# Altium schematic sheet MPU Allwinner A33.SchDoc
size A2; SheetNumber: 9; SheetTotal: 9
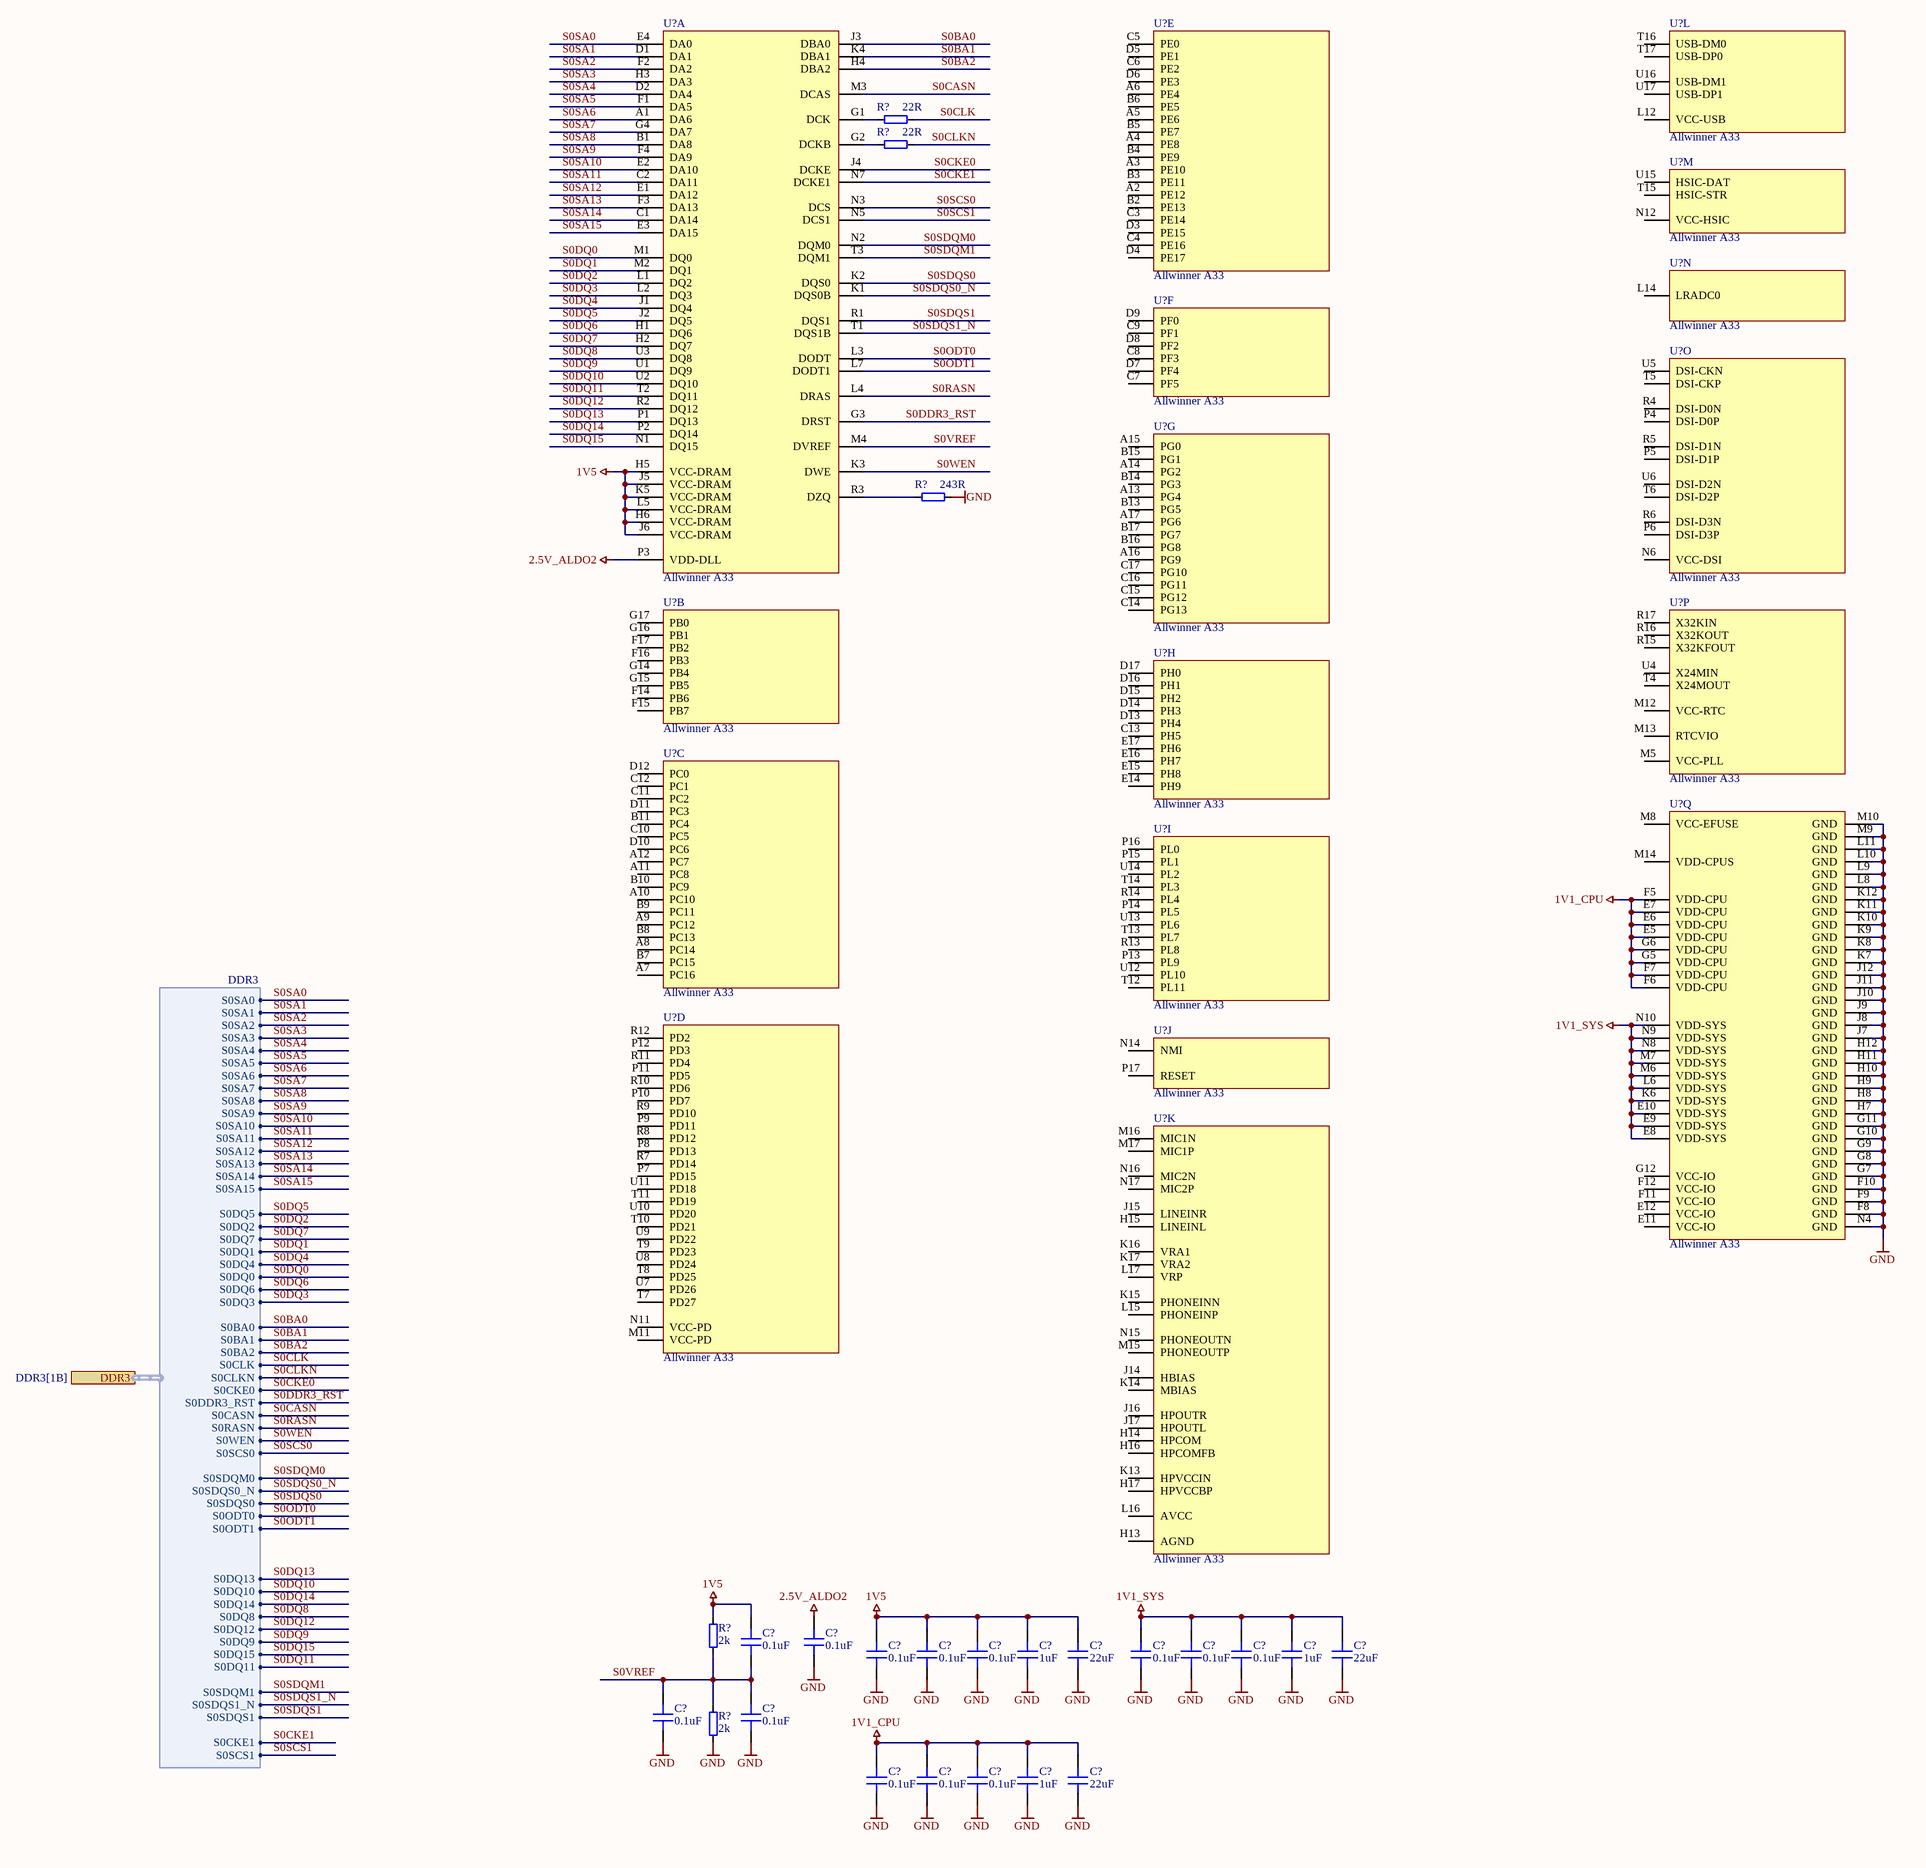
[diagram p0: MPU Allwinner A33.SchDoc]

## Parts
(Parts that share a designator on the sheet are numbered #1, #2 ... from top to bottom, then left to right.)
C?#1  0.1uF  [CAPC1005X06N]
C?#2  0.1uF  [CAPC1005X06N]
C?#3  0.1uF  [CAPC1005X06N]
C?#4  0.1uF  [CAPC1005X06N]
C?#5  0.1uF  [CAPC1005X06N]
C?#6  1uF  [CAPC1608X09N]
C?#7  22uF  [CAPC3216X16N]
C?#8  0.1uF  [CAPC1005X06N]
C?#9  0.1uF  [CAPC1005X06N]
C?#10  0.1uF  [CAPC1005X06N]
C?#11  1uF  [CAPC1608X09N]
C?#12  22uF  [CAPC3216X16N]
C?#13  0.1uF  [CAPC1005X06N]
C?#14  0.1uF  [CAPC1005X06N]
C?#15  0.1uF  [CAPC1005X06N]
C?#16  0.1uF  [CAPC1005X06N]
C?#17  0.1uF  [CAPC1005X06N]
C?#18  1uF  [CAPC1608X09N]
C?#19  22uF  [CAPC3216X16N]
R?#1  22R  [RESC1005X35N]
R?#2  22R  [RESC1005X35N]
R?#3  243R  [RESC1005X35N]
R?#4  2k  [RESC1005X35N]
R?#5  2k  [RESC1005X35N]
U?#1  Allwinner A33  [BGA282C80P17X17_1400X1400X130(Allwinner A33)]  (part L of 17)
U?#2  Allwinner A33  [BGA282C80P17X17_1400X1400X130(Allwinner A33)]  (part E of 17)
U?#3  Allwinner A33  [BGA282C80P17X17_1400X1400X130(Allwinner A33)]  (part M of 17)
U?#4  Allwinner A33  [BGA282C80P17X17_1400X1400X130(Allwinner A33)]  (part N of 17)
U?#5  Allwinner A33  [BGA282C80P17X17_1400X1400X130(Allwinner A33)]  (part A of 17)
U?#6  Allwinner A33  [BGA282C80P17X17_1400X1400X130(Allwinner A33)]  (part F of 17)
U?#7  Allwinner A33  [BGA282C80P17X17_1400X1400X130(Allwinner A33)]  (part O of 17)
U?#8  Allwinner A33  [BGA282C80P17X17_1400X1400X130(Allwinner A33)]  (part G of 17)
U?#9  Allwinner A33  [BGA282C80P17X17_1400X1400X130(Allwinner A33)]  (part B of 17)
U?#10  Allwinner A33  [BGA282C80P17X17_1400X1400X130(Allwinner A33)]  (part P of 17)
U?#11  Allwinner A33  [BGA282C80P17X17_1400X1400X130(Allwinner A33)]  (part H of 17)
U?#12  Allwinner A33  [BGA282C80P17X17_1400X1400X130(Allwinner A33)]  (part C of 17)
U?#13  Allwinner A33  [BGA282C80P17X17_1400X1400X130(Allwinner A33)]  (part I of 17)
U?#14  Allwinner A33  [BGA282C80P17X17_1400X1400X130(Allwinner A33)]  (part Q of 17)
U?#15  Allwinner A33  [BGA282C80P17X17_1400X1400X130(Allwinner A33)]  (part J of 17)
U?#16  Allwinner A33  [BGA282C80P17X17_1400X1400X130(Allwinner A33)]  (part D of 17)
U?#17  Allwinner A33  [BGA282C80P17X17_1400X1400X130(Allwinner A33)]  (part K of 17)

## Ports
DDR3 (harness DDR3, see DDR3[1B])

## Harnesses
DDR3: S0SA0, S0SA1, S0SA2, S0SA3, S0SA4, S0SA5, S0SA6, S0SA7, S0SA8, S0SA9, S0SA10, S0SA11, S0SA12, S0SA13, S0SA14, S0SA15, S0DQ5, S0DQ2, S0DQ7, S0DQ1, S0DQ4, S0DQ0, S0DQ6, S0DQ3, S0BA0, S0BA1, S0BA2, S0CLK, S0CLKN, S0CKE0, S0DDR3_RST, S0CASN, S0RASN, S0WEN, S0SCS0, S0SDQM0, S0SDQS0_N, S0SDQS0, S0ODT0, S0ODT1, S0DQ13, S0DQ10, S0DQ14, S0DQ8, S0DQ12, S0DQ9, S0DQ15, S0DQ11, S0SDQM1, S0SDQS1_N, S0SDQS1, S0CKE1, S0SCS1

## Nets
1V1_CPU: C?#15.1 C?#16.1 C?#17.1 C?#18.1 C?#19.2 U?#14.E5(VDD-CPU) U?#14.E6(VDD-CPU) U?#14.E7(VDD-CPU) U?#14.F5(VDD-CPU) U?#14.F6(VDD-CPU) U?#14.F7(VDD-CPU) U?#14.G5(VDD-CPU) U?#14.G6(VDD-CPU)
1V1_SYS: C?#8.1 C?#9.1 C?#10.1 C?#11.1 C?#12.2 U?#14.E8(VDD-SYS) U?#14.E9(VDD-SYS) U?#14.E10(VDD-SYS) U?#14.K6(VDD-SYS) U?#14.L6(VDD-SYS) U?#14.M6(VDD-SYS) U?#14.M7(VDD-SYS) U?#14.N8(VDD-SYS) U?#14.N9(VDD-SYS) U?#14.N10(VDD-SYS)
1V5: C?#1.1 C?#3.1 C?#4.1 C?#5.1 C?#6.1 C?#7.2 R?#4.1 U?#5.H5(VCC-DRAM) U?#5.H6(VCC-DRAM) U?#5.J5(VCC-DRAM) U?#5.J6(VCC-DRAM) U?#5.K5(VCC-DRAM) U?#5.L5(VCC-DRAM)
2.5V_ALDO2: C?#2.1 U?#5.P3(VDD-DLL)
GND: C?#2.2 C?#3.2 C?#4.2 C?#5.2 C?#6.2 C?#7.1 C?#8.2 C?#9.2 C?#10.2 C?#11.2 C?#12.1 C?#13.2 C?#14.2 C?#15.2 C?#16.2 C?#17.2 C?#18.2 C?#19.1 R?#3.1 R?#5.2 U?#14.F8(GND) U?#14.F9(GND) U?#14.F10(GND) U?#14.G7(GND) U?#14.G8(GND) U?#14.G9(GND) U?#14.G10(GND) U?#14.G11(GND) U?#14.H7(GND) U?#14.H8(GND) U?#14.H9(GND) U?#14.H10(GND) U?#14.H11(GND) U?#14.H12(GND) U?#14.J7(GND) U?#14.J8(GND) U?#14.J9(GND) U?#14.J10(GND) U?#14.J11(GND) U?#14.J12(GND) U?#14.K7(GND) U?#14.K8(GND) U?#14.K9(GND) U?#14.K10(GND) U?#14.K11(GND) U?#14.K12(GND) U?#14.L8(GND) U?#14.L9(GND) U?#14.L10(GND) U?#14.L11(GND) U?#14.M9(GND) U?#14.M10(GND) U?#14.N4(GND)
S0BA0: U?#5.J3(DBA0) ; port DDR3.S0BA0
S0BA1: U?#5.K4(DBA1) ; port DDR3.S0BA1
S0BA2: U?#5.H4(DBA2) ; port DDR3.S0BA2
S0CASN: U?#5.M3(DCAS) ; port DDR3.S0CASN
S0CKE0: U?#5.J4(DCKE) ; port DDR3.S0CKE0
S0CKE1: U?#5.N7(DCKE1) ; port DDR3.S0CKE1
S0CLK: R?#1.1 ; port DDR3.S0CLK
S0CLKN: R?#2.1 ; port DDR3.S0CLKN
S0DDR3_RST: U?#5.G3(DRST) ; port DDR3.S0DDR3_RST
S0DQ0: U?#5.M1(DQ0) ; port DDR3.S0DQ0
S0DQ1: U?#5.M2(DQ1) ; port DDR3.S0DQ1
S0DQ2: U?#5.L1(DQ2) ; port DDR3.S0DQ2
S0DQ3: U?#5.L2(DQ3) ; port DDR3.S0DQ3
S0DQ4: U?#5.J1(DQ4) ; port DDR3.S0DQ4
S0DQ5: U?#5.J2(DQ5) ; port DDR3.S0DQ5
S0DQ6: U?#5.H1(DQ6) ; port DDR3.S0DQ6
S0DQ7: U?#5.H2(DQ7) ; port DDR3.S0DQ7
S0DQ8: U?#5.U3(DQ8) ; port DDR3.S0DQ8
S0DQ9: U?#5.U1(DQ9) ; port DDR3.S0DQ9
S0DQ10: U?#5.U2(DQ10) ; port DDR3.S0DQ10
S0DQ11: U?#5.T2(DQ11) ; port DDR3.S0DQ11
S0DQ12: U?#5.R2(DQ12) ; port DDR3.S0DQ12
S0DQ13: U?#5.P1(DQ13) ; port DDR3.S0DQ13
S0DQ14: U?#5.P2(DQ14) ; port DDR3.S0DQ14
S0DQ15: U?#5.N1(DQ15) ; port DDR3.S0DQ15
S0ODT0: U?#5.L3(DODT) ; port DDR3.S0ODT0
S0ODT1: U?#5.L7(DODT1) ; port DDR3.S0ODT1
S0RASN: U?#5.L4(DRAS) ; port DDR3.S0RASN
S0SA0: U?#5.E4(DA0) ; port DDR3.S0SA0
S0SA1: U?#5.D1(DA1) ; port DDR3.S0SA1
S0SA2: U?#5.F2(DA2) ; port DDR3.S0SA2
S0SA3: U?#5.H3(DA3) ; port DDR3.S0SA3
S0SA4: U?#5.D2(DA4) ; port DDR3.S0SA4
S0SA5: U?#5.F1(DA5) ; port DDR3.S0SA5
S0SA6: U?#5.A1(DA6) ; port DDR3.S0SA6
S0SA7: U?#5.G4(DA7) ; port DDR3.S0SA7
S0SA8: U?#5.B1(DA8) ; port DDR3.S0SA8
S0SA9: U?#5.F4(DA9) ; port DDR3.S0SA9
S0SA10: U?#5.E2(DA10) ; port DDR3.S0SA10
S0SA11: U?#5.C2(DA11) ; port DDR3.S0SA11
S0SA12: U?#5.E1(DA12) ; port DDR3.S0SA12
S0SA13: U?#5.F3(DA13) ; port DDR3.S0SA13
S0SA14: U?#5.C1(DA14) ; port DDR3.S0SA14
S0SA15: U?#5.E3(DA15) ; port DDR3.S0SA15
S0SCS0: U?#5.N3(DCS) ; port DDR3.S0SCS0
S0SCS1: U?#5.N5(DCS1) ; port DDR3.S0SCS1
S0SDQM0: U?#5.N2(DQM0) ; port DDR3.S0SDQM0
S0SDQM1: U?#5.T3(DQM1) ; port DDR3.S0SDQM1
S0SDQS0: U?#5.K2(DQS0) ; port DDR3.S0SDQS0
S0SDQS0_N: U?#5.K1(DQS0B) ; port DDR3.S0SDQS0_N
S0SDQS1: U?#5.R1(DQS1) ; port DDR3.S0SDQS1
S0SDQS1_N: U?#5.T1(DQS1B) ; port DDR3.S0SDQS1_N
S0VREF: C?#1.2 C?#13.1 C?#14.1 R?#4.2 R?#5.1 U?#5.M4(DVREF)
S0WEN: U?#5.K3(DWE) ; port DDR3.S0WEN
NetR?#1_2: R?#1.2 U?#5.G1(DCK)
NetR?#2_2: R?#2.2 U?#5.G2(DCKB)
NetR?#3_2: R?#3.2 U?#5.R3(DZQ)

Not connected (* = marked no-connect by the designer): U?#1 L12(VCC-USB) T16(USB-DM0) T17(USB-DP0) U16(USB-DM1) U17(USB-DP1); U?#2 A2(PE12) A3(PE10) A4(PE8) A5(PE6) A6(PE4) B2(PE13) B3(PE11) B4(PE9) B5(PE7) B6(PE5) C3(PE14) C4(PE16) C5(PE0) C6(PE2) D3(PE15) D4(PE17) D5(PE1) D6(PE3); U?#3 N12(VCC-HSIC) T15(HSIC-STR) U15(HSIC-DAT); U?#4 L14(LRADC0); U?#6 C7(PF5) C8(PF3) C9(PF1) D7(PF4) D8(PF2) D9(PF0); U?#7 N6(VCC-DSI) P4(DSI-D0P) P5(DSI-D1P) P6(DSI-D3P) R4(DSI-D0N) R5(DSI-D1N) R6(DSI-D3N) T5(DSI-CKP) T6(DSI-D2P) U5(DSI-CKN) U6(DSI-D2N); U?#8 A13(PG4) A14(PG2) A15(PG0) A16(PG9) A17(PG6) B13(PG5) B14(PG3) B15(PG1) B16(PG8) B17(PG7) C14(PG13) C15(PG12) C16(PG11) C17(PG10); U?#9 F14(PB6) F15(PB7) F16(PB3) F17(PB2) G14(PB4) G15(PB5) G16(PB1) G17(PB0); U?#10 M5(VCC-PLL) M12(VCC-RTC) M13(RTCVIO) R15(X32KFOUT) R16(X32KOUT) R17(X32KIN) T4(X24MOUT) U4(X24MIN); U?#11 C13(PH5) D13(PH4) D14(PH3) D15(PH2) D16(PH1) D17(PH0) E14(PH9) E15(PH8) E16(PH7) E17(PH6); U?#12 A7(PC16) A8(PC14) A9(PC12) A10(PC10) A11(PC8) A12(PC7) B7(PC15) B8(PC13) B9(PC11) B10(PC9) B11(PC4) C10(PC5) C11(PC2) C12(PC1) D10(PC6) D11(PC3) D12(PC0); U?#13 P13(PL9) P14(PL5) P15(PL1) P16(PL0) R13(PL8) R14(PL4) T12(PL11) T13(PL7) T14(PL3) U12(PL10) U13(PL6) U14(PL2); U?#14 E11(VCC-IO) E12(VCC-IO) F11(VCC-IO) F12(VCC-IO) G12(VCC-IO) M8(VCC-EFUSE) M14(VDD-CPUS); U?#15 N14(NMI) P17(RESET); U?#16 M11(VCC-PD) N11(VCC-PD) P7(PD15) P8(PD13) P9(PD11) P10(PD7) P11(PD5) P12(PD3) R7(PD14) R8(PD12) R9(PD10) R10(PD6) R11(PD4) R12(PD2) T7(PD27) T8(PD25) T9(PD23) T10(PD21) T11(PD19) U7(PD26) U8(PD24) U9(PD22) U10(PD20) U11(PD18); U?#17 H13(AGND) H14(HPCOM) H15(LINEINL) H16(HPCOMFB) H17(HPVCCBP) J14(HBIAS) J15(LINEINR) J16(HPOUTR) J17(HPOUTL) K13(HPVCCIN) K14(MBIAS) K15(PHONEINN) K16(VRA1) K17(VRA2) L15(PHONEINP) L16(AVCC) L17(VRP) M15(PHONEOUTP) M16(MIC1N) M17(MIC1P) N15(PHONEOUTN) N16(MIC2N) N17(MIC2P)

## Library data of the parts
C?#1-C?#5 C?#8-C?#10 C?#13-C?#17 = 0402B104K500CT: Manufacturer: Walsin Tech Corp; Voltage: 50V; Tolerance: 10%; Dielectric: X7R; Min Temperature: -55; Max Temperature: 125; Part Number: 0402B104K500CT; ComponentLink1URL: https://datasheet.lcsc.com/lcsc/1810191621_Walsin-Tech-Corp-0402B104K500CT_C152814.pdf; ComponentLink1Description: Datasheet; Package: 0402; Part Status: Active; Capacitance: 0.1uF
C?#6 C?#11 C?#18 = 0603B105K160CT: Manufacturer: Walsin Tech Corp; Voltage: 16V; Tolerance: 10%; Dielectric: X7R; Min Temperature: -55; Max Temperature: 125; Part Number: 0603B105K160CT; ComponentLink1URL: https://datasheet.lcsc.com/lcsc/1811151141_Walsin-Tech-Corp-0603B105K160CT_C108463.pdf; ComponentLink1Description: Datasheet; Package: 0603; Part Status: Active; Capacitance: 1uF
C?#7 C?#12 C?#19 = 1206B226K100CT: Manufacturer: Walsin Tech Corp; Voltage: 10V; Tolerance: 10%; Dielectric: X7R; Min Temperature: -55; Max Temperature: 125; Part Number: 1206B226K100CT; ComponentLink1URL: https://datasheet.lcsc.com/lcsc/2209151800_Walsin-Tech-Corp-1206B226K100CT_C237195.pdf; ComponentLink1Description: Datasheet; Package: 1206; Part Status: Active; Capacitance: 22uF
R?#1 R?#2 = FRC0402F22R0TS: Resistor; Manufacturer: FOJAN; Tolerance: 1%; Power: 1/16 W; Temperature Coefficient: 100ppm; Min Temperature: -55°C; Max Temperature: 155°C; Part Number: FRC0402F22R0TS; ComponentLink1URL: https://datasheet.lcsc.com/lcsc/2201121430_FOJAN-FRC0402F22R0TS_C2929994.pdf; ComponentLink1Description: Datasheet; Package: 0402; Part Status: Active; Resistance: 22R
R?#3 = FRC0402F2430TS: Resistor; Manufacturer: FOJAN; Tolerance: 1%; Power: 1/16 W; Temperature Coefficient: 100ppm; Min Temperature: -55°C; Max Temperature: 155°C; Part Number: FRC0402F2430TS; ComponentLink1URL: https://datasheet.lcsc.com/lcsc/2201121430_FOJAN-FRC0402F2430TS_C2929995.pdf; ComponentLink1Description: Datasheet; Package: 0402; Part Status: Active; Resistance: 243R
R?#4 R?#5 = WR04X2001FTL: Resistor; Manufacturer: Walsin Tech Corp; Tolerance: 1%; Power: 1/16 W; Temperature Coefficient: 100ppm; Min Temperature: -55°C; Max Temperature: 155°C; Part Number: WR04X2001FTL; ComponentLink1URL: https://datasheet.lcsc.com/lcsc/1810191630_Walsin-Tech-Corp-WR04X2001FTL_C163822.pdf; ComponentLink1Description: Datasheet; Package: 0402; Part Status: Active; Resistance: 2k
U?#1-U?#17 = Allwinner A33: Manufacturer: Allwinner Technology Co., Ltd.; Part Number: Allwinner A33; ComponentLink1URL: http://dl.linux-sunxi.org/A33/A33%20Datasheet%20release%201.1.pdf; ComponentLink1Description: Datasheet; ComponentLink2URL: http://dl.linux-sunxi.org/A33/A33%20user%20manual%20release%201.1.pdf; ComponentLink2Description: User manual; Package: BGA-282; Part Status: Active